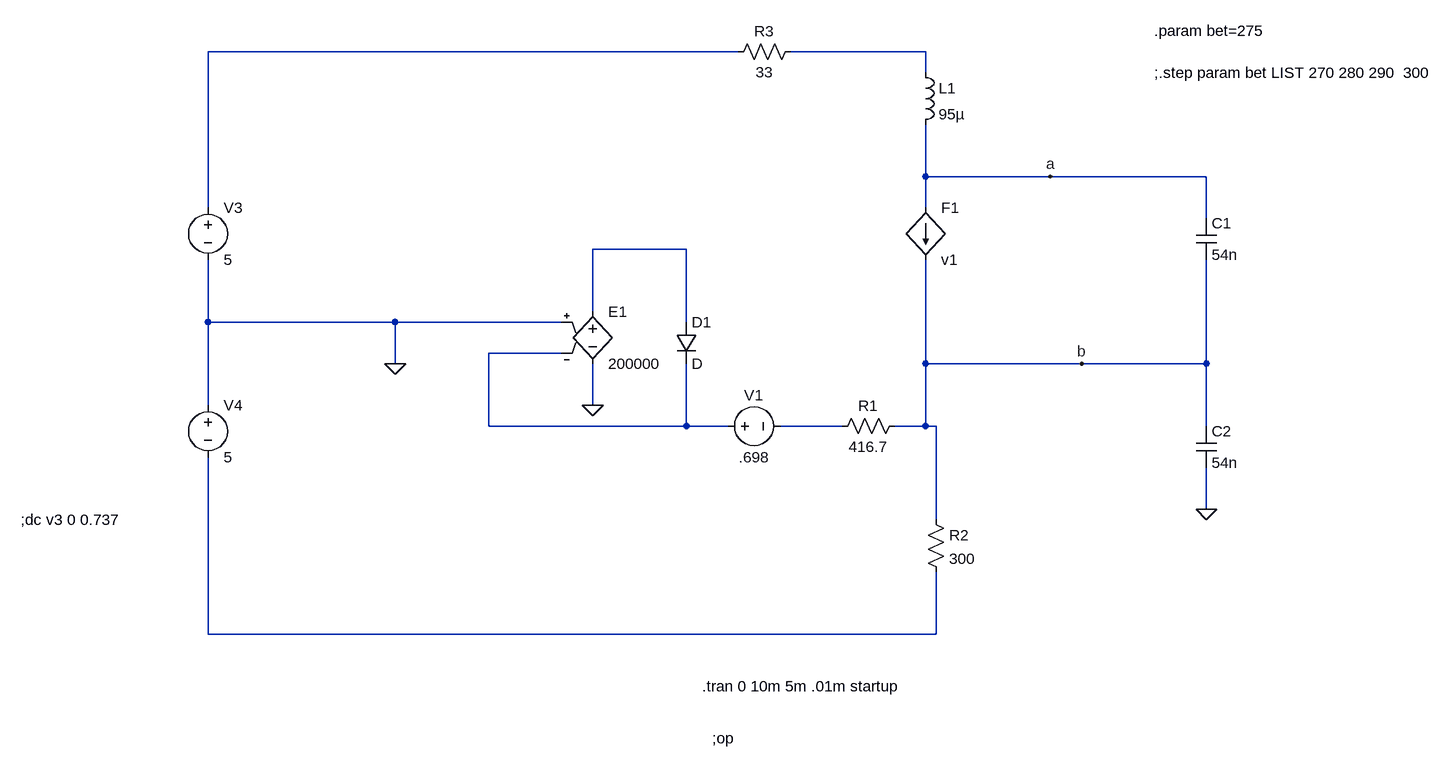
[diagram p0: schematic Colpitts_caos2.asc]
Colpitts_caos2.asc, the LTspice schematic file:
Version 4
SHEET 1 1272 852
WIRE 32 -224 -784 -224
WIRE 320 -224 112 -224
WIRE 320 -192 320 -224
WIRE 320 -32 320 -112
WIRE 512 -32 320 -32
WIRE 752 -32 512 -32
WIRE -784 16 -784 -224
WIRE 320 16 320 -32
WIRE 752 32 752 -32
WIRE -48 80 -192 80
WIRE -192 176 -192 80
WIRE -784 192 -784 96
WIRE -496 192 -784 192
WIRE -240 192 -496 192
WIRE -48 192 -48 80
WIRE -240 240 -352 240
WIRE -496 256 -496 192
WIRE 320 256 320 96
WIRE 560 256 320 256
WIRE 752 256 752 96
WIRE 752 256 560 256
WIRE -784 320 -784 192
WIRE -192 320 -192 256
WIRE -352 352 -352 240
WIRE -48 352 -48 256
WIRE -48 352 -352 352
WIRE 16 352 -48 352
WIRE 192 352 96 352
WIRE 320 352 320 256
WIRE 320 352 272 352
WIRE 336 352 320 352
WIRE 752 352 752 256
WIRE 752 480 752 416
WIRE 336 496 336 352
WIRE -784 672 -784 400
WIRE 336 672 336 576
WIRE 336 672 -784 672
FLAG -192 320 0
FLAG -496 256 0
FLAG 752 480 0
FLAG 512 -32 a
FLAG 560 256 b
SYMBOL e -192 160 R0
SYMATTR InstName E1
SYMATTR Value 200000
SYMBOL diode -64 192 R0
SYMATTR InstName D1
SYMBOL res 288 336 R90
WINDOW 0 0 56 VBottom 2
WINDOW 3 32 56 VTop 2
SYMATTR InstName R1
SYMATTR Value 416.7
SYMBOL voltage 0 352 R270
WINDOW 0 32 56 VTop 2
WINDOW 3 -32 56 VBottom 2
WINDOW 123 0 0 Left 2
WINDOW 39 0 0 Left 2
SYMATTR InstName V1
SYMATTR Value .698
SYMBOL f 320 16 R0
SYMATTR InstName F1
SYMATTR Value v1
SYMATTR Value2 {bet}
SYMBOL voltage -784 0 R0
WINDOW 123 0 0 Left 2
WINDOW 39 0 0 Left 2
SYMATTR InstName V3
SYMATTR Value 5
SYMBOL voltage -784 304 R0
WINDOW 123 0 0 Left 2
WINDOW 39 0 0 Left 2
SYMATTR InstName V4
SYMATTR Value 5
SYMBOL res 320 480 R0
SYMATTR InstName R2
SYMATTR Value 300
SYMBOL ind 304 -208 R0
SYMATTR InstName L1
SYMATTR Value 95µ
SYMBOL res 128 -240 R90
WINDOW 0 0 56 VBottom 2
WINDOW 3 32 56 VTop 2
SYMATTR InstName R3
SYMATTR Value 33
SYMBOL cap 736 32 R0
SYMATTR InstName C1
SYMATTR Value 54n
SYMBOL cap 736 352 R0
SYMATTR InstName C2
SYMATTR Value 54n
TEXT -8 832 Left 2 !;op
TEXT -24 752 Left 2 !.tran 0 10m 5m .01m startup
TEXT -1072 496 Left 2 !;dc v3 0 0.737
TEXT 672 -256 Left 2 !.param bet=275
TEXT 672 -192 Left 2 !;.step param bet LIST 270 280 290  300

The netlist it stands for:
* Colpitts_caos2.asc
E1 N003 0 0 N004 200000
D1 N003 N004 D
R1 b N005 416.7
V1 N004 N005 .698
F1 a b v1 {bet}
V3 N001 0 5
V4 0 N006 5
R2 b N006 300
L1 N002 a 95µ
R3 N002 N001 33
C1 a b 54n
C2 b 0 54n
.model D D
.lib standard.dio
;op
.tran 0 10m 5m .01m startup
;dc v3 0 0.737
.param bet=275
;.step param bet LIST 270 280 290  300
.backanno
.end